# EAGLE design rt_board (EAGLE 6.4)
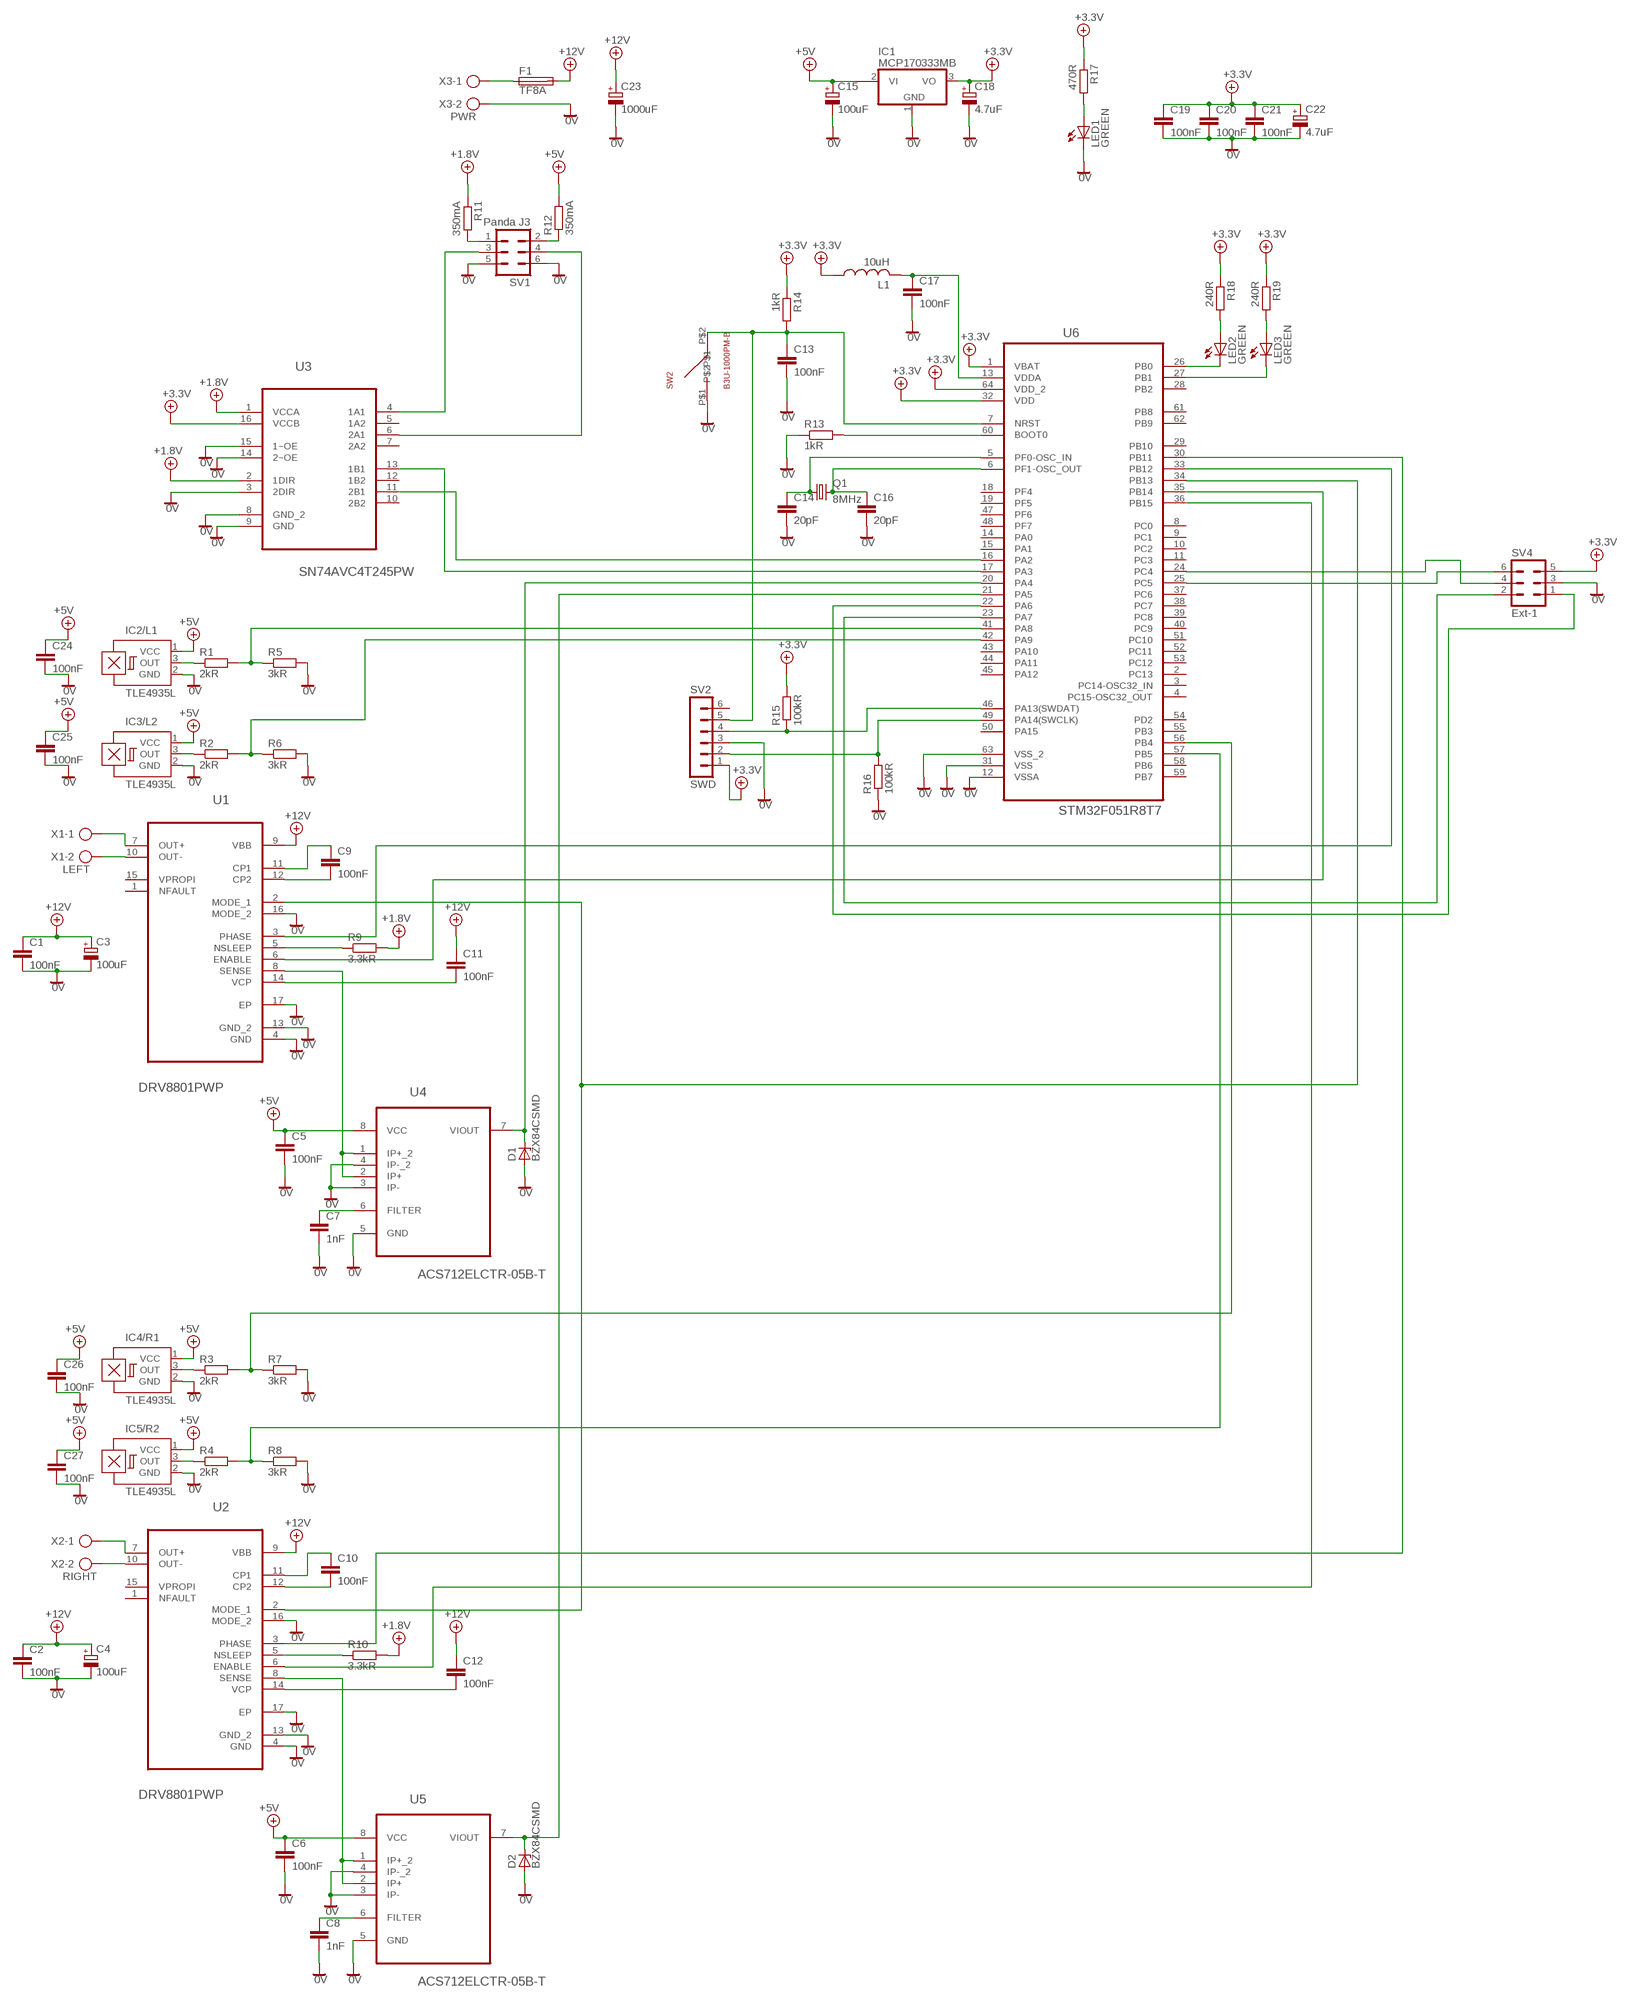
[diagram p0: schematic, sheet 1]

## Parts
C1  100nF  C-EUC1206  [C1206]
C2  100nF  C-EUC1206  [C1206]
C3  100uF  CPOL-EU153CLV-0810  [153CLV-0810]
C4  100uF  CPOL-EU153CLV-0810  [153CLV-0810]
C5  100nF  C-EUC1206  [C1206]
C6  100nF  C-EUC1206  [C1206]
C7  1nF  C-EUC1206  [C1206]
C8  1nF  C-EUC1206  [C1206]
C9  100nF  C-EUC1206  [C1206]
C10  100nF  C-EUC1206  [C1206]
C11  100nF  C-EUC1206  [C1206]
C12  100nF  C-EUC1206  [C1206]
C13  100nF  C-EUC1206  [C1206]
C14  20pF  C-EUC0603  [C0603]
C15  100uF  CPOL-EU153CLV-0605  [153CLV-0605]
C16  20pF  C-EUC0603  [C0603]
C17  100nF  C-EUC1206  [C1206]
C18  4.7uF  CPOL-EU153CLV-0405  [153CLV-0405]
C19  100nF  C-EUC1206  [C1206]
C20  100nF  C-EUC1206  [C1206]
C21  100nF  C-EUC1206  [C1206]
C22  4.7uF  CPOL-EU153CLV-0405  [153CLV-0405]
C23  1000uF  CPOL-EU153CLV-1014  [153CLV-1014]
C24  100nF  C-EUC1206  [C1206]
C25  100nF  C-EUC1206  [C1206]
C26  100nF  C-EUC1206  [C1206]
C27  100nF  C-EUC1206  [C1206]
D1  BZX84CSMD  [TO236]
D2  BZX84CSMD  [TO236]
F1  TF8A  SH22  [SH22]
IC1  MCP170333MB  [SOT89]
IC2/L1  TLE4935L  A1202UA  [SIP3-UA]
IC3/L2  TLE4935L  A1202UA  [SIP3-UA]
IC4/R1  TLE4935L  A1202UA  [SIP3-UA]
IC5/R2  TLE4935L  A1202UA  [SIP3-UA]
L1  10uH  L-USL2012C  [L2012C]
LED1  GREEN  LEDCHIPLED_0603  [CHIPLED_0603]
LED2  GREEN  LEDCHIPLED_0603  [CHIPLED_0603]
LED3  GREEN  LEDCHIPLED_0603  [CHIPLED_0603]
Q1  8MHz  MC-405  [MC-405]
R1  2kR  R-EU_R0603  [R0603]
R2  2kR  R-EU_R0603  [R0603]
R3  2kR  R-EU_R0603  [R0603]
R4  2kR  R-EU_R0603  [R0603]
R5  3kR  R-EU_R0603  [R0603]
R6  3kR  R-EU_R0603  [R0603]
R7  3kR  R-EU_R0603  [R0603]
R8  3kR  R-EU_R0603  [R0603]
R9  3.3kR  R-EU_R0603  [R0603]
R10  3.3kR  R-EU_R0603  [R0603]
R11  350mA  R-EU_MELF0204W  [MINI_MELF-0204W]
R12  350mA  R-EU_MELF0204W  [MINI_MELF-0204W]
R13  1kR  R-EU_R0603  [R0603]
R14  1kR  R-EU_R0603  [R0603]
R15  100kR  R-EU_R0603  [R0603]
R16  100kR  R-EU_R0603  [R0603]
R17  470R  R-EU_R0603  [R0603]
R18  240R  R-EU_R0603  [R0603]
R19  240R  R-EU_R0603  [R0603]
SV1  Panda J3  MA03-2  [MA03-2]
SV2  SWD  MA06-1  [MA06-1]
SV4  Ext-1  MA03-2  [MA03-2]
SW2  B3U-1000PM-B  [SPST-NO]
U1  DRV8801PWP  [SOP65P640X120-17N]
U2  DRV8801PWP  [SOP65P640X120-17N]
U3  SN74AVC4T245PW  [SOP65P640X120-16N]
U4  ACS712ELCTR-05B-T  ACS712ELCTR-20A-T  [SOIC127P600X175-8N]
U5  ACS712ELCTR-05B-T  ACS712ELCTR-20A-T  [SOIC127P600X175-8N]
U6  STM32F051R8T7  STM32F051R8T6  [QFP50P1200X1200X160-64N]
X1  LEFT  AK300/2  [AK300/2]
X2  RIGHT  AK300/2  [AK300/2]
X3  PWR  AK300/2  [AK300/2]

## Nets
0V: C1.2 C2.2 C3.- C4.- C5.2 C6.2 C7.2 C8.2 C13.2 C14.2 C15.- C16.2 C17.2 C18.- C19.2 C20.2 C21.2 C22.- C23.- C24.2 C25.2 C26.2 C27.2 D1.A D2.A IC1.1(GND) IC2/L1.2(GND) IC3/L2.2(GND) IC4/R1.2(GND) IC5/R2.2(GND) LED1.C R5.2 R6.2 R7.2 R8.2 R13.1 R16.1 SV1.5 SV1.6 SV2.3 SV4.3 SW2.P$1 U1.4(GND) U1.13(GND_2) U1.16(MODE_2) U1.17(EP) U2.4(GND) U2.13(GND_2) U2.16(MODE_2) U2.17(EP) U3.3(2DIR) U3.8(GND_2) U3.9(GND) U3.14(2~OE) U3.15(1~OE) U4.3(IP-) U4.4(IP-_2) U4.5(GND) U5.3(IP-) U5.4(IP-_2) U5.5(GND) U6.12(VSSA) U6.31(VSS) U6.63(VSS_2) X3.2
+5V: C18.+ C19.1 C20.1 C21.1 C22.+ IC1.3(VO) L1.1 R14.1 R15.2 R17.1 R18.1 R19.1 SV2.1 SV4.5 U3.16(VCCB) U6.1(VBAT) U6.32(VDD) U6.64(VDD_2) ; supply symbol labelled +3.3V
+5V/1: C5.1 C6.1 C15.+ C24.1 C25.1 C26.1 C27.1 IC1.2@1(VI1) IC2/L1.1(VCC) IC3/L2.1(VCC) IC4/R1.1(VCC) IC5/R2.1(VCC) R12.2 U4.8(VCC) U5.8(VCC) ; supply symbol labelled +5V
+5V/4: R9.2 R10.2 R11.1 U3.1(VCCA) U3.2(1DIR) ; supply symbol labelled +1.8V
+12V: C1.1 C2.1 C3.+ C4.+ C11.1 C12.1 C23.+ F1.2 U1.9(VBB) U2.9(VBB)
N$1: LED2.C U6.26(PB0)
N$2: F1.1 X3.1
N$3: C17.1 L1.2 U6.13(VDDA)
N$4: R16.2 SV2.2 U6.49(PA14(SWCLK))
N$5: R13.2 U6.60(BOOT0)
N$6: C13.1 R14.2 SV2.5 SW2.P$2 U6.7(NRST)
N$7: C14.1 Q1.1 U6.5(PF0-OSC_IN)
N$8: C16.1 Q1.2 U6.6(PF1-OSC_OUT)
N$9: R15.1 SV2.4 U6.46(PA13(SWDAT))
N$10: R12.1 SV1.2
N$11: R11.2 SV1.1
N$12: SV1.3 U3.4(1A1)
N$13: U3.13(1B1) U6.17(PA3)
N$14: U3.11(2B1) U6.16(PA2)
N$15: SV1.4 U3.6(2A1)
N$16: IC2/L1.3(OUT) R1.1
N$17: R1.2 R5.1 U6.41(PA8)
N$18: IC3/L2.3(OUT) R2.1
N$19: R2.2 R6.1 U6.42(PA9)
N$20: U1.7(OUT+) X1.1
N$21: U1.10(OUT-) X1.2
N$22: U1.8(SENSE) U4.1(IP+_2) U4.2(IP+)
N$23: D1.C U4.7(VIOUT) U6.20(PA4)
N$24: C7.1 U4.6(FILTER)
N$25: R9.1 U1.5(NSLEEP)
N$26: C11.2 U1.14(VCP)
N$27: C9.2 U1.12(CP2)
N$28: C9.1 U1.11(CP1)
N$29: IC4/R1.3(OUT) R3.1
N$30: R3.2 R7.1 U6.56(PB4)
N$31: IC5/R2.3(OUT) R4.1
N$32: R4.2 R8.1 U6.57(PB5)
N$33: U2.7(OUT+) X2.1
N$34: U2.10(OUT-) X2.2
N$35: C8.1 U5.6(FILTER)
N$36: U2.8(SENSE) U5.1(IP+_2) U5.2(IP+)
N$37: D2.C U5.7(VIOUT) U6.21(PA5)
N$38: R10.1 U2.5(NSLEEP)
N$39: C12.2 U2.14(VCP)
N$40: C10.2 U2.12(CP2)
N$41: C10.1 U2.11(CP1)
N$42: U1.2(MODE_1) U2.2(MODE_1) U6.34(PB13)
N$43: LED1.A R17.2
N$44: LED2.A R18.2
N$45: U1.6(ENABLE) U6.35(PB14)
N$46: U2.6(ENABLE) U6.36(PB15)
N$47: LED3.C U6.27(PB1)
N$48: U1.3(PHASE) U6.33(PB12)
N$49: U2.3(PHASE) U6.30(PB11)
N$51: LED3.A R19.2
N$52: SV4.6 U6.25(PC5)
N$53: SV4.4 U6.24(PC4)
N$54: SV4.2 U6.23(PA7)
N$55: SV4.1 U6.22(PA6)
Unconnected: IC1.2(VI) SV2.6 U1.1(NFAULT) U1.15(VPROPI) U2.1(NFAULT) U2.15(VPROPI) U3.5(1A2) U3.7(2A2) U3.10(2B2) U3.12(1B2) U6.2(PC13) U6.3(PC14-OSC32_IN) U6.4(PC15-OSC32_OUT) U6.8(PC0) U6.9(PC1) U6.10(PC2) U6.11(PC3) U6.14(PA0) U6.15(PA1) U6.18(PF4) U6.19(PF5) U6.28(PB2) U6.29(PB10) U6.37(PC6) U6.38(PC7) U6.39(PC8) U6.40(PC9) U6.43(PA10) U6.44(PA11) U6.45(PA12) U6.47(PF6) U6.48(PF7) U6.50(PA15) U6.51(PC10) U6.52(PC11) U6.53(PC12) U6.54(PD2) U6.55(PB3) U6.58(PB6) U6.59(PB7) U6.61(PB8) U6.62(PB9)

## Library data of the parts
C1 C2 C5-C14 C16 C17 C19-C21 C24-C27 = rcl:C-EU: CAPACITOR, European symbol
C3 C4 C15 C18 C22 C23 = rcl:CPOL-EU: POLARIZED CAPACITOR, European symbol
D1 D2 = diode:BZX84CSMD: Z DIODE
F1 = fuse:SH22: FUSE HOLDER CS PFP30, Schukat; OC_FARNELL: unknown; OC_NEWARK: unknown
IC1 = linear:MCP1703*: 250 mA, 16V, Low Quiescent Current LDO Regulator Source: http://ww1.microchip.com/downloads/en/DeviceDoc/22049b.pdf
IC2/L1 IC3/L2 IC4/R1 IC5/R2 = allegro:A12*?: Hall-effect bipolar switch Source: http://www.allegromicro.com/en/Products/Part_Numbers/1202/1202.pdf; OC_FARNELL: unknown; OC_NEWARK: unknown
L1 = rcl:L-US: INDUCTOR, American symbol
LED1-LED3 = led:LED: LED OSRAM: - CHIPLED LG R971, LG N971, LY N971, LG Q971, LY Q971, LO R971, LY R971 LH N974, LH R974 LS Q976, LO Q976, LY Q976 LO Q996 - Hyper CHIPLED LW Q18S LB Q993, LB Q99A, LB R99A - SideLED LS A670, LO A670, LY A670, LG A670, LP A670 LB A673, LV A673, LT A673, LW A673 LH A674 LY A675 LS A676, LA A676, LO A676, LY A676, LW A676 LS A679, LY A679, LG A679 - Hyper Micro SIDELED® LS Y876, LA Y876, LO Y876, LY Y876 LT Y87S - SmartLED LW L88C, LW L88S LB L89C, LB L89S, LG L890 LS L89K, LO L89K, LY L89K LS L896, LA L896, LO L896, LY L896 - TOPLED LS T670, LO T670, LY T670, LG T670, LP T670 LSG T670, LSP T670, LSY T670, LOP T670, LYG T670 LG T671, LOG T671, LSG T671 LB T673, LV T673, LT T673, LW T673 LH T674 LS T676, LA T676, LO T676, LY T676, LB T676, LH T676, LSB T676, LW T676 LB T67C, LV T67C, LT T67C, LS T67K, LO T67K, LY T67K, LW E67C LS E67B, LA E67B, LO E67B, LY E67B, LB E67C, LV E67C, LT E67C LW T67C LS T679, LY T679, LG T679 LS T770, LO T770, LY T770, LG T770, LP T770 LB T773, LV T773, LT T773, LW T773 LH T774 LS E675, LA E675, LY E675, LS T675 LS T776, LA T776, LO T776, LY T776, LB T776 LHGB T686 LT T68C, LB T68C - Hyper Mini TOPLED® LB M676 - Mini TOPLED Santana® LG M470 LS M47K, LO M47K, LY M47K Source: http://www.osram.convergy.de LUXEON: - LUMILED® LXK2-PW12-R00, LXK2-PW12-S00, LXK2-PW14-U00, LXK2-PW14-V00 LXK2-PM12-R00, LXK2-PM12-S00, LXK2-PM14-U00 LXK2-PE12-Q00, LXK2-PE12-R00, LXK2-PE12-S00, LXK2-PE14-T00, LXK2-PE14-U00 LXK2-PB12-K00, LXK2-PB12-L00, LXK2-PB12-M00, LXK2-PB14-N00, LXK2-PB14-P00, LXK2-PB14-Q00 LXK2-PR12-L00, LXK2-PR12-M00, LXK2-PR14-Q00, LXK2-PR14-R00 LXK2-PD12-Q00, LXK2-PD12-R00, LXK2-PD12-S00 LXK2-PH12-R00, LXK2-PH12-S00 LXK2-PL12-P00, LXK2-PL12-Q00, LXK2-PL12-R00 Source: www.luxeon.com KINGBRIGHT: KA-3528ASYC Source: www.kingbright.com
Q1 = crystal:MC-405: kHz RANGE CRYSTAL UNIT SMD Source: MC-306_405_406_E07X.PDF Homepage <http://www.epsontoyocom.co.jp>; OC_FARNELL: unknown; OC_NEWARK: unknown
R1-R19 = rcl:R-EU_: RESISTOR, European symbol
SV1 SV4 = con-lstb:MA03-2: PIN HEADER; OC_FARNELL: unknown; OC_NEWARK: unknown
SV2 = con-lstb:MA06-1: PIN HEADER; OC_FARNELL: unknown; OC_NEWARK: unknown
SW2 = basz:B3U-1000PM-B: B3U-1000PM-B microswitch
U1 U2 = TI-DRV8801PWP:DRV8801PWP: DMOS FULL-BRIDGE MOTOR DRIVERS; MPN: DRV8801PWP; OC_FARNELL: 1754826; OC_NEWARK: 24R9114; PACKAGE: TSSOP-16; SUPPLIER: TEXAS INSTRUMENTS
U3 = TI-SN74AVC4T245PW:SN74AVC4T245PW: DUAL-SUPPLY BUS TRANSCEIVER; MPN: SN74AVC4T245PW; OC_FARNELL: 1053499; OC_NEWARK: 33K5889; PACKAGE: SOP-16; SUPPLIER: Texas Instruments
U4 U5 = Allegro-ACS712ELCTR-20A-T:ACS712ELCTR-20A-T: Linear Current Sensor; MPN: ACS712ELCTR-20A-T; OC_FARNELL: 1329624; OC_NEWARK: 31M3133; PACKAGE: SOIC-8; SUPPLIER: Allegro
U6 = stm32f51r8r6:STM32F051R8T6: MCU, 32BIT, ARM CORTEX-M0, 64LQFP; MPN: STM32F051R8T6; OC_FARNELL: 2115071; OC_NEWARK: 05W5808; PACKAGE: 64LQFP; SUPPLIER: STMicroelectronics
X1-X3 = con-ptr500:AK300/2: CONNECTOR; OC_FARNELL: unknown; OC_NEWARK: unknown

## Board
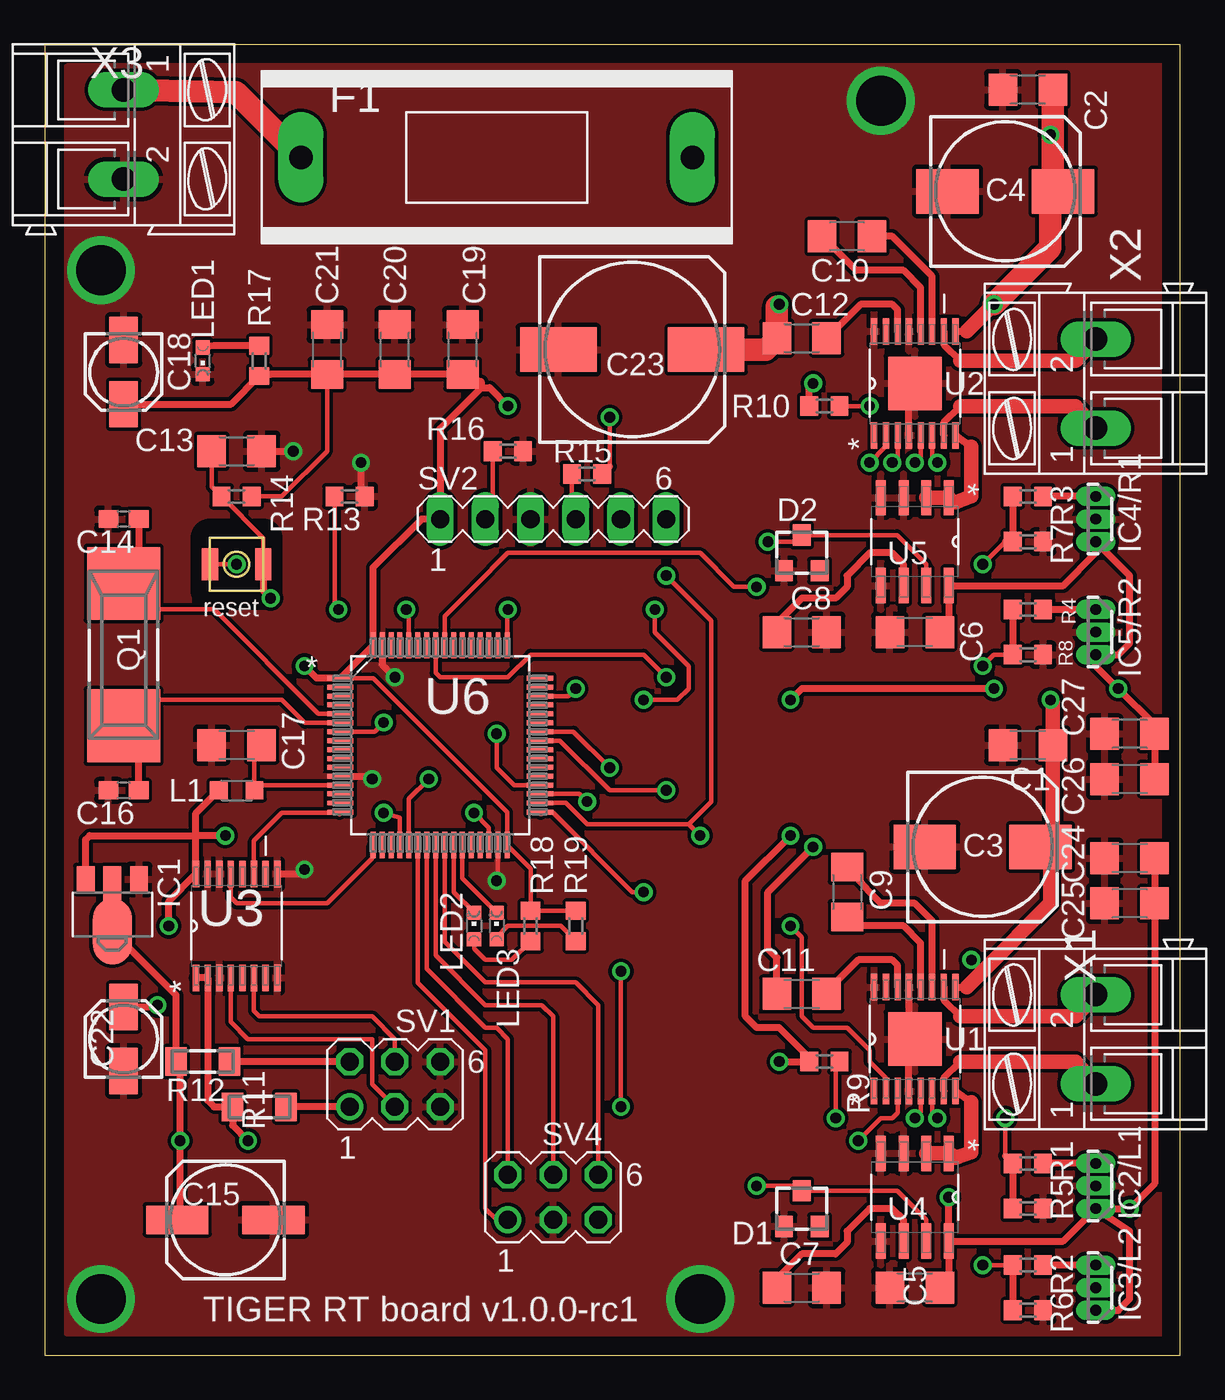
[diagram p1: board, top side]
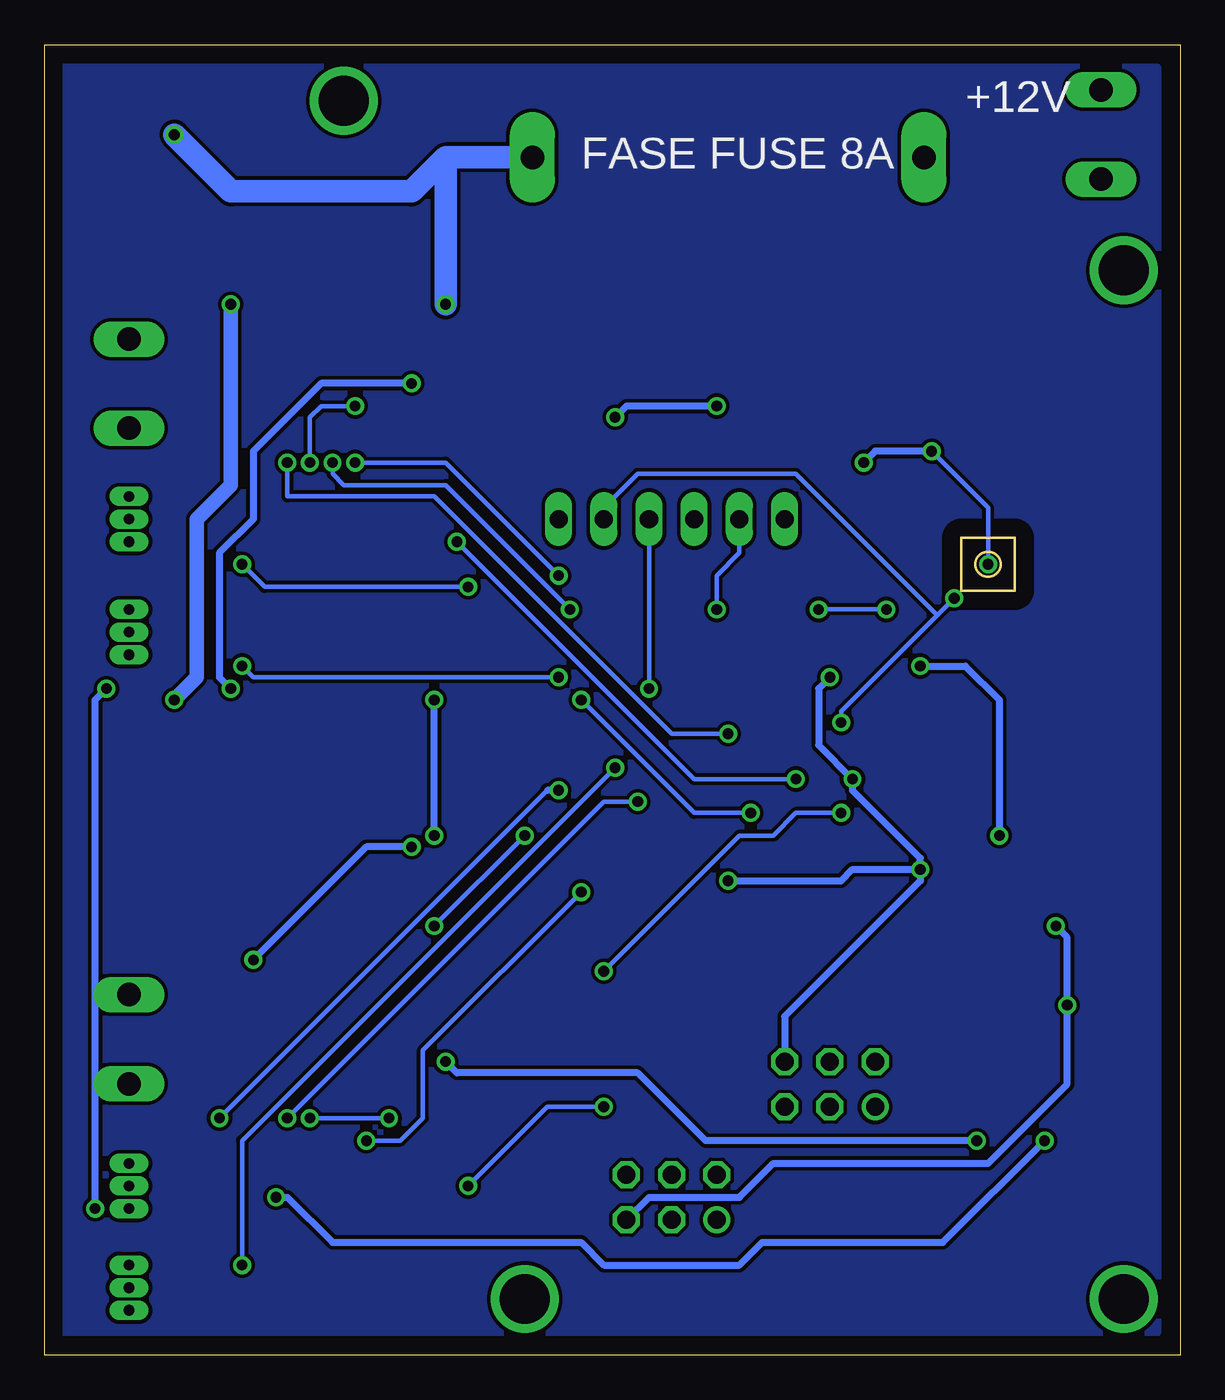
[diagram p2: board, bottom side, seen from below]

Size 63.8 x 73.65 mm. Coordinates in mm from the lower left corner, seen from the top.
Outline: 0,0 63.8,0 63.8,73.65 0,73.65 0,0
Copper layers (1*16): Top 0.035mm / dielectric 1.5mm / Bottom 0.035mm
Design rules "default": minimum track width 10mil, minimum drill 24mil, track to track 8mil, track to pad 8mil, pad to pad 8mil, via to via 8mil, smd to smd 8mil, copper to edge 40mil, drill to drill 8mil, minimum pad ring 10mil, minimum via ring 8mil, stop-mask expansion 4mil, vias tented up to drill 0mil, thermal gap 10mil

### Footprints (pad centres in the part's own frame; a part is rotated, then mirrored left to right if it is on the bottom)
C1206 = smd 1.6 x 1.8: 1 -1.4,0; 2 1.4,0
153CLV-0810 = smd 3.5 x 2.5: + 3.25,0; - -3.25,0
C0603 = smd 1.1 x 1: 1 -0.85,0; 2 0.85,0
153CLV-0605 = smd 3.5 x 1.6: + 2.7,0; - -2.7,0
153CLV-0405 = smd 2.6 x 1.6: + 1.8,0; - -1.8,0
153CLV-1014 = smd 4.3 x 2.5: + 4.15,0; - -4.15,0
TO236 = smd 1 x 1.2: A -1,-1; C 0,1; NC 1,-1
SH22 = drill 1.321 pad 2.54 long: 1 -10.998,0; 2 10.998,0
SOT89 = smd 1 x 1.5: 1 -1.499,-1.981; 3 1.499,-1.981 | smd 1 x 2: 2 0,-1.727 | smd 2.2 x 3.7: 2@1 0,0.94
SIP3-UA = drill 0.6 pad 0.7 long: 1 -1.27,0; 2 0,0; 3 1.27,0
L2012C = smd 1 x 1: 1 -1,0; 2 1,0
CHIPLED_0603 = smd 0.8 x 0.8: A 0,-0.75; C 0,0.75
MC-405 = smd 4.1 x 4.1: 1 -4,0; 2 4,0
R0603 = smd 1 x 1.1: 1 -0.85,0; 2 0.85,0
MINI_MELF-0204W = smd 1.2 x 1.6: 1 -1.5,0; 2 1.5,0
MA03-2 = drill 1.016: 1 -2.54,-1.27 | drill 1.016 octagon: 2 -2.54,1.27; 3 0,-1.27; 4 0,1.27; 5 2.54,-1.27; 6 2.54,1.27
MA06-1 = drill 1.016 long: 1 -6.35,0; 2 -3.81,0; 3 -1.27,0; 4 1.27,0; 5 3.81,0; 6 6.35,0
SPST-NO = smd 0.914 x 1.778: P$1 -1.5,0; P$2 1.5,0
SOP65P640X120-17N = smd 1.473 x 0.356: 1 -2.921,2.286; 2 -2.921,1.626; 3 -2.921,0.965; 4 -2.921,0.33; 5 -2.921,-0.33; 6 -2.921,-0.965; 7 -2.921,-1.626; 8 -2.921,-2.286; 9 2.921,-2.286; 10 2.921,-1.626; 11 2.921,-0.965; 12 2.921,-0.33; 13 2.921,0.33; 14 2.921,0.965; 15 2.921,1.626; 16 2.921,2.286 | smd 2.997 x 2.997: 17 0,0
SOP65P640X120-16N = smd 1.473 x 0.356: 1 -2.921,2.286; 2 -2.921,1.626; 3 -2.921,0.965; 4 -2.921,0.33; 5 -2.921,-0.33; 6 -2.921,-0.965; 7 -2.921,-1.626; 8 -2.921,-2.286; 9 2.921,-2.286; 10 2.921,-1.626; 11 2.921,-0.965; 12 2.921,-0.33; 13 2.921,0.33; 14 2.921,0.965; 15 2.921,1.626; 16 2.921,2.286
SOIC127P600X175-8N = smd 1.981 x 0.559: 1 -2.464,1.905; 2 -2.464,0.635; 3 -2.464,-0.635; 4 -2.464,-1.905; 5 2.464,-1.905; 6 2.464,-0.635; 7 2.464,0.635; 8 2.464,1.905
QFP50P1200X1200X160-64N = smd 1.473 x 0.279: 1 -5.613,3.759; 2 -5.613,3.251; 3 -5.613,2.743; 4 -5.613,2.261; 5 -5.613,1.753; 6 -5.613,1.245; 7 -5.613,0.762; 8 -5.613,0.254; 9 -5.613,-0.254; 10 -5.613,-0.762; 11 -5.613,-1.245; 12 -5.613,-1.753; 13 -5.613,-2.261; 14 -5.613,-2.743; 15 -5.613,-3.251; 16 -5.613,-3.759; 33 5.613,-3.759; 34 5.613,-3.251; 35 5.613,-2.743; 36 5.613,-2.261; 37 5.613,-1.753; 38 5.613,-1.245; 39 5.613,-0.762; 40 5.613,-0.254; 41 5.613,0.254; 42 5.613,0.762; 43 5.613,1.245; 44 5.613,1.753; 45 5.613,2.261; 46 5.613,2.743; 47 5.613,3.251; 48 5.613,3.759 | smd 0.279 x 1.473: 17 -3.759,-5.613; 18 -3.251,-5.613; 19 -2.743,-5.613; 20 -2.261,-5.613; 21 -1.753,-5.613; 22 -1.245,-5.613; 23 -0.762,-5.613; 24 -0.254,-5.613; 25 0.254,-5.613; 26 0.762,-5.613; 27 1.245,-5.613; 28 1.753,-5.613; 29 2.261,-5.613; 30 2.743,-5.613; 31 3.251,-5.613; 32 3.759,-5.613; 49 3.759,5.613; 50 3.251,5.613; 51 2.743,5.613; 52 2.261,5.613; 53 1.753,5.613; 54 1.245,5.613; 55 0.762,5.613; 56 0.254,5.613; 57 -0.254,5.613; 58 -0.762,5.613; 59 -1.245,5.613; 60 -1.753,5.613; 61 -2.261,5.613; 62 -2.743,5.613; 63 -3.251,5.613; 64 -3.759,5.613
AK300/2 = drill 1.321 long: 1 -2.515,0; 2 2.489,0

### Placement (x,y rotation side)
C1  55.25,34.29 180 top
C2  55.25,71.12 180 top
C3  52.7,28.57 0 top
C4  53.97,65.41 0 top
C5  48.89,3.81 180 top
C6  48.89,40.64 180 top
C7  42.55,3.81 0 top
C8  42.55,40.64 0 top
C9  45.09,26.03 270 top
C10  45.09,62.87 180 top
C11  42.55,20.32 0 top
C12  42.55,57.15 0 top
C13  10.79,50.8 0 top
C14  4.45,46.99 180 top
C15  10.16,7.62 180 top
C16  4.45,31.75 180 top
C17  10.79,34.29 180 top
C18  4.45,55.24 270 top
C19  23.49,56.52 90 top
C20  19.69,56.52 90 top
C21  15.88,56.52 90 top
C22  4.45,17.78 90 top
C23  33.02,56.52 0 top
C24  60.96,27.94 180 top
C25  60.96,25.4 180 top
C26  60.96,32.38 180 top
C27  60.96,34.92 180 top
D1  42.55,8.26 0 top
D2  42.55,45.09 0 top
F1  25.4,67.31 0 top
IC1  3.81,24.77 180 top
IC2/L1  59.05,9.53 90 top
IC3/L2  59.05,3.81 90 top
IC4/R1  59.05,46.99 90 top
IC5/R2  59.05,40.64 90 top
L1  10.79,31.75 0 top
LED1  8.89,55.88 180 top
LED2  24.13,24.13 0 top
LED3  25.4,24.13 0 top
Q1  4.45,39.37 270 top
R1  55.25,10.79 180 top
R2  55.25,5.08 180 top
R3  55.25,48.26 180 top
R4  55.25,41.91 180 top
R5  55.25,8.26 0 top
R6  55.25,2.54 0 top
R7  55.25,45.72 0 top
R8  55.25,39.37 0 top
R9  43.81,16.51 180 top
R10  43.81,53.34 180 top
R11  12.06,13.97 0 top
R12  8.89,16.51 180 top
R13  17.15,48.26 180 top
R14  10.79,48.26 180 top
R15  30.48,49.53 0 top
R16  26.03,50.8 180 top
R17  12.06,55.88 90 top
R18  27.3,24.13 270 top
R19  29.84,24.13 270 top
SV1  19.69,15.24 0 top
SV2  28.57,46.99 0 top
SV4  28.57,8.89 0 top
SW2  10.79,44.45 0 top
U1  48.89,17.78 90 top
U2  48.89,54.61 90 top
U3  10.79,24.13 90 top
U4  48.89,8.89 270 top
U5  48.89,45.72 270 top
U6  22.23,34.29 0 top
X1  59.05,17.78 90 top
X2  59.05,54.61 90 top
X3  4.45,68.58 270 top

### Tracks (layer width: path | path; a pad name or v marks a point on that pad's centre or on a via)
0V  (via drill 0.6, 2.8)
  Top 0.254: SW2.P$1 v10.79,44.45 | U6.31 25.48,26.75
  Top 0.406: U3.9 14.35,27.05 v14.6,27.3 | C13.2 v13.97,50.8 | v17.78,50.16 17.78,48.48 R13.1 | U1.4 48.56,17.45 U1.17 48.56,18.11 U1.13 | U2.4 48.56,54.28 U2.17 | U6.12 17.93,32.54 v18.41,32.38 | U6.63 18.97,38.81 v19.69,38.1 | 25.48,26.75 v25.4,26.67
  Bottom 0.254: v10.79,44.45 10.79,47.62 v13.97,50.8
  Bottom 0.406: v14.6,27.3 14.6,26.67 22.23,19.05 SV1.6 | v13.97,50.8 17.15,50.8 v17.78,50.16 | v14.6,27.3 14.6,27.94 18.41,31.75 v18.41,32.38 20.32,34.29 20.32,37.46 v19.69,38.1 | v25.4,26.67 19.05,26.67 18.41,27.3 v14.6,27.3
  other vias: 3.18,60.96 3.18,3.18 36.83,3.18 46.99,70.48
  pour Top: 1.27,72.39 1.27,1.27 62.86,1.27 62.86,72.39
+5V  (via drill 0.6)
  Top 0.254: R14.1 13.33,48.26 15.88,50.8 C21.1 | U6.1 18.47,38.05 25.98,30.53 U6.32 27.3,27.36 R18.1 R19.1 | v31.75,52.7 31.75,49.95
  Top 0.406: 8.51,29.21 U3.16 6.99,25.53 v6.99,24.13 | 8.51,29.21 8.51,30.46 L1.1 | IC1.3 2.31,28.98 2.54,29.21 8.51,29.21 | 24.53,54.38 24.53,54.71 C19.1 C20.1 C21.1 12.7,55.12 R17.1 10.48,53.45 C18.+ | 24.53,54.38 22.23,52.07 SV2.1 21.19,46.99 18.47,44.27 U6.64 U6.1 15.29,38.05 v14.6,38.73 | v10.16,29.21 8.51,29.21 | 24.53,54.38 25,54.38 v26.03,53.34 | 31.75,49.95 R15.2 | C22.+ 6.24,19.58 v6.35,19.69 | 30.06,24.77 R19.1
  Bottom 0.406: v14.6,38.73 12.06,38.73 10.16,36.83 v10.16,29.21 | v26.03,53.34 31.11,53.34 v31.75,52.7 | v6.99,24.13 6.35,23.49 v6.35,19.69 6.35,15.24 10.79,10.79 22.86,10.79 24.77,8.89 29.84,8.89 SV4.5
+5V/1  (via drill 0.6)
  Top 0.406: U4.8 50.8,4.31 C5.1 | U4.8 57.23,6.43 IC2/L1.1 | IC3/L2.1 60.33,2.54 60.96,3.18 60.96,6.99 IC2/L1.1 | C6.1 50.8,41.14 U5.8 57.23,43.26 59.05,45.09 IC4/R1.1 60.96,43.81 60.96,40 60.33,39.37 IC5/R2.1 59.05,38.73 v60.33,37.46 62.36,35.43 C27.1 C26.1 | IC2/L1.1 v60.96,8.26 62.36,9.65 C25.1 C24.1 | IC1.2@1 7.39,20.24 R12.2 7.62,16.28 v7.62,12.06 7.62,7.62 C15.+ | U4.8 v50.8,8.89
  Bottom 0.406: v60.96,8.26 60.96,36.83 v60.33,37.46 | v50.8,8.89 50.16,8.89 47.62,6.35 33.66,6.35 32.38,5.08 24.77,5.08 23.49,6.35 13.33,6.35 v7.62,12.06
+5V/4  (via drill 0.6)
  Top 0.406: U3.1 U3.2 9.17,14.33 9.53,13.97 R11.1 10.56,12.93 v11.43,12.06 | v41.27,16.51 R9.2 42.96,16.73 41.27,18.41 40,18.41 39.37,19.05 39.37,26.67 v41.91,29.21 | R10.2 42.96,54.39 v43.18,54.61 | v53.34,37.46 42.55,37.46 v41.91,36.83
  Bottom 0.406: v11.43,12.06 26.67,12.06 30.48,15.88 40.64,15.88 v41.27,16.51 | v41.91,29.21 v41.91,36.83 | v43.18,54.61 48.26,54.61 52.07,50.8 52.07,46.99 53.97,45.09 53.97,38.1 v53.34,37.46
+12V  (via drill 0.6)
  Top 0.406: U1.9 51.82,20.7 | 56.52,27.23 56.87,27.59 | 56.87,27.59 C3.+ | 56.64,27.81 56.87,27.59 | U2.9 51.82,57.53 | 56.52,64.06 56.87,64.42 | 56.87,64.42 C4.+ | 56.64,64.64 56.87,64.42 | 56.64,36.7 v56.52,36.83 | 57.15,71.12 56.52,71.25 C2.1 | C11.1 41.14,22.35 40.64,22.86 40.64,26.03 v43.18,28.57 | v52.07,22.23 52.7,21.59 | 56.64,68.58 v56.52,68.58 | 41.14,58.93 v41.27,59.05
  Top 0.813: 51.82,20.7 52.7,21.59 56.52,25.4 56.52,27.23 | 56.64,27.81 C1.1 56.64,36.7 | 51.82,57.53 v53.34,59.05
  Top 1.27: v53.34,59.05 56.52,62.23 56.52,64.06 | C2.1 56.64,68.58 56.64,64.64 | 41.14,58.93 C12.1 40.51,56.52 C23.+
  Bottom 0.406: v43.18,28.57 45.72,28.57 v52.07,22.23
  Bottom 0.813: v56.52,36.83 55.25,38.1 55.25,46.99 53.34,48.89 v53.34,59.05
  Bottom 1.27: F1.2 41.27,67.31 | 41.27,67.31 43.18,65.41 53.34,65.41 v56.52,68.58 | v41.27,59.05 41.27,67.31
N$1
  Top 0.254: U6.26 22.99,26.03 24.13,24.89
  Top 0.406: LED2.C 24.13,24.89
N$2
  Top 1.27: X3.1 10.75,70.97 F1.1
N$3
  Top 0.254: U6.13 12.07,32.03 | L1.2 11.79,33.89
  Top 0.406: 12.07,32.03 L1.2 | 11.79,33.89 C17.1
N$4  (via drill 0.6)
  Top 0.254: R16.2 25.18,47.41 SV2.2 | U6.49 25.98,41.86
  Top 0.406: 25.98,41.86 v26.03,41.91
  Bottom 0.254: v26.03,41.91 26.03,43.81 24.77,45.09 SV2.2
N$5  (via drill 0.6)
  Top 0.254: R13.2 16.3,42.12 v16.51,41.91 | U6.60 20.47,41.76 v20.32,41.91
  Bottom 0.254: v16.51,41.91 v20.32,41.91
N$6  (via drill 0.6)
  Top 0.254: C13.1 9.4,48.81 R14.2 12.29,45.91 SW2.P$2 | U6.7 18.54,35.05 v19.05,35.56
  Top 0.406: SW2.P$2 12.29,42.95 v12.7,42.55
  Bottom 0.254: v12.7,42.55 13.65,41.59 | 13.65,41.59 19.05,36.2 v19.05,35.56 | 32.38,47.62 30.48,49.53 21.59,49.53 13.65,41.59
  Bottom 0.406: SV2.5 32.38,47.62
N$7
  Top 0.254: U6.5 15.39,36.04 9.53,41.91 5.9,41.91
  Top 0.406: 5.9,41.91 Q1.1 5.29,44.22 C14.1
N$8
  Top 0.254: U6.6 14.63,35.53 13.33,36.83 5.9,36.83
  Top 0.406: 5.9,36.83 Q1.2 5.29,34.52 C16.1
N$9  (via drill 0.6)
  Top 0.254: U6.46 29.41,37.03 v29.84,37.46 | R15.1 29.63,47.2 SV2.4
  Bottom 0.254: v29.84,37.46 SV2.4
N$10
  Top 0.406: SV1.2 R12.1
N$11
  Top 0.406: SV1.1 R11.2
N$12
  Top 0.254: U3.4 10.47,18.74 11.43,17.78 18.41,17.78 18.41,15.24 SV1.3
N$13
  Top 0.254: U3.13 10.47,25.73 10.79,25.4 15.88,25.4 18.41,27.94 18.41,28.63 U6.17
N$14
  Top 0.254: U3.11 11.76,28.91 13.33,30.48 16.56,30.48
  Top 0.406: 16.56,30.48 U6.16
N$15
  Top 0.254: U3.6 11.76,19.35 12.06,19.05 18.41,19.05 19.69,17.78 SV1.4
N$16
  Top 0.406: IC2/L1.3 R1.1
N$17  (via drill 0.6)
  Top 0.254: U6.41 28.96,34.54 31.75,31.75 v34.92,31.75 | v53.97,13.33 53.97,11.22
  Top 0.406: R5.1 R1.2 53.97,11.22
  Bottom 0.254: 35.56,31.75 v53.97,13.33
  Bottom 0.406: v34.92,31.75 35.56,31.75
N$18
  Top 0.406: IC3/L2.3 R2.1
N$19  (via drill 0.6)
  Top 0.254: U6.42 29.72,35.05 v31.75,33.02 | v52.7,5.08 R2.2
  Top 0.406: R2.2 R6.1
  Bottom 0.254: v31.75,33.02 52.7,12.06 v52.7,5.08
N$20
  Top 0.406: U1.7 50.52,15.6 51.43,16.51
  Top 0.813: 51.43,16.51 57.94,16.51 X1.1
N$21
  Top 0.406: U1.10 50.52,19.96 51.43,19.05
  Top 0.813: 51.43,19.05 57.94,19.05 X1.2
N$22
  Top 0.406: U1.8 52.07,14.22
  Top 0.813: 52.07,14.22 52.07,11.43 51.18,11.1 U4.1 U4.2
N$23  (via drill 0.6)
  Top 0.254: D1.C 47.89,9.26 49.53,7.62 U4.7 | v40,9.53 42.27,9.53 | U6.20 19.96,30.2 v19.05,30.48 | v32.38,21.59 v32.38,13.97
  Top 0.406: 42.27,9.53 D1.C
  Bottom 0.254: v32.38,13.97 35.56,13.97 v40,9.53 | v19.05,30.48 21.59,30.48 22.86,29.21 24.77,29.21 v32.38,21.59
N$24
  Top 0.406: U4.6 48.26,7.62 47.62,8.26 46.35,8.26 45.09,6.99 45.09,6.35 44.45,5.71 42.55,5.71 41.27,4.45 41.27,3.94 C7.1
N$25  (via drill 0.6)
  Top 0.254: U1.5 49.23,13.67 v48.89,13.33 | v44.45,13.33 44.45,16.3
  Top 0.406: 44.45,16.3 R9.1
  Bottom 0.254: v48.89,13.33 v44.45,13.33
N$26
  Top 0.406: U1.14 47.93,21.92 47.62,22.23 45.72,22.23 44.45,20.95 43.81,20.45 C11.2
N$27
  Top 0.406: U1.12 49.23,23.16 48.26,24.13 45.59,24.13 C9.2
N$28
  Top 0.406: U1.11 49.86,24.44 48.89,25.4 46.99,25.4 46.35,26.03 C9.1
N$29
  Top 0.406: IC4/R1.3 R3.1
N$30  (via drill 0.6)
  Top 0.254: U6.56 22.48,41.53 24.13,43.18 26.03,45.09 36.83,45.09 38.73,43.18 v40,43.18 | v52.7,44.45 53.97,45.72
  Top 0.406: R3.2 R7.1 53.97,45.72
  Bottom 0.254: v40,43.18 51.43,43.18 v52.7,44.45
N$31
  Top 0.406: R4.1 IC5/R2.3
N$32  (via drill 0.6)
  Top 0.254: U6.57 21.97,38.35 22.23,38.1 26.03,38.1 27.3,39.37 33.66,39.37 v34.92,38.1 | v52.7,38.73 53.34,39.37 R8.1
  Top 0.406: R4.2 R8.1
  Bottom 0.254: v34.92,38.1 52.07,38.1 v52.7,38.73
N$33
  Top 0.406: U2.7 50.52,52.43 51.43,53.34
  Top 0.813: 51.43,53.34 57.94,53.34 X2.1
N$34
  Top 0.406: U2.10 50.52,56.79 51.43,55.88
  Top 0.813: 51.43,55.88 57.94,55.88 X2.2
N$35
  Top 0.406: U5.6 48.26,44.45 47.62,45.09 46.35,45.09 45.09,43.81 45.09,43.18 44.45,42.55 42.55,42.55 41.27,41.27 41.27,40.77 C8.1
N$36
  Top 0.406: U2.8 52.07,51.05 | 51.18,47.93 U5.1
  Top 0.813: 52.07,51.05 52.07,48.26 51.18,47.93 | U5.1 U5.2
N$37  (via drill 0.6)
  Top 0.254: U5.7 49.53,44.45 47.89,46.09 D2.C 42.18,45.72 v40.64,45.72 | U6.21 20.47,31.27 v21.59,32.38
  Bottom 0.254: v21.59,32.38 27.3,32.38 v40.64,45.72
N$38  (via drill 0.6)
  Top 0.254: U2.5 49.23,50.49 v48.89,50.16 | R10.1 v46.35,53.34
  Bottom 0.254: v48.89,50.16 48.89,52.7 48.26,53.34 v46.35,53.34
N$39
  Top 0.406: U2.14 47.93,58.75 47.62,59.05 45.85,59.05 C12.2
N$40
  Top 0.406: U2.12 49.23,59.99 48.26,60.96 45.59,60.96 C10.2
N$41
  Top 0.406: U2.11 49.86,60.63 47.62,62.87 C10.1
N$42  (via drill 0.6)
  Top 0.254: U2.2 47.27,51.08 v46.35,50.16 | U6.34 29.29,31.04 30.48,29.84 36.2,29.84 | 36.2,29.84 37.46,31.12 37.46,41.27 v34.92,43.81 | U1.2 47.27,15.6 46.35,16.51 46.35,17.15 45.09,18.41 43.18,18.41 42.55,19.05 42.55,23.49 v41.91,24.13 | v36.83,29.21 36.2,29.84
  Bottom 0.254: v46.35,50.16 41.27,50.16 v34.92,43.81 | v41.91,24.13 v36.83,29.21
N$43
  Top 0.406: R17.2 9.53,56.73 LED1.A
N$44
  Top 0.254: LED2.A 24.13,22.86 24.77,22.23 26.25,22.23 R18.2
N$45  (via drill 0.6)
  Top 0.254: U6.35 30.05,31.55 v30.48,31.12 | U1.6 49.86,13.67 v50.16,13.33
  Bottom 0.254: v50.16,13.33 32.38,31.12 v30.48,31.12
N$46  (via drill 0.6)
  Top 0.254: U6.36 26.39,32.03 25.4,33.02 v25.4,34.92 | U2.6 49.86,50.49 v50.16,50.16
  Bottom 0.254: v25.4,34.92 28.57,34.92 41.91,48.26 50.16,48.26 v50.16,50.16
N$47
  Top 0.254: U6.27 23.47,26.81 LED3.C
N$48  (via drill 0.6)
  Top 0.254: U1.3 47.93,13.64 47.62,13.33 46.99,13.33 v45.72,12.06 | v33.66,26.03 33.02,26.03 28.57,30.48 27.89,30.48
  Top 0.406: 27.89,30.48 U6.33
  Bottom 0.254: v45.72,12.06 43.81,12.06 42.55,13.33 42.55,17.15 v33.66,26.03
N$49  (via drill 0.6)
  Top 0.254: U2.3 47.93,50.47 v47.62,50.16 | v34.29,41.91 34.29,40.64 36.2,38.73 36.2,37.46 35.56,36.83 v33.66,36.83 | U6.30 24.97,29.64 v24.13,30.48
  Bottom 0.254: v47.62,50.16 47.62,49.53 46.99,48.89 41.27,48.89 v34.29,41.91 | v24.13,30.48 27.3,30.48 v33.66,36.83
N$50
  pour Bottom: 1.27,72.39 1.27,1.27 63.5,1.27 63.5,72.39
N$51
  Top 0.254: 25.4,23.49 26.03,24.13 28.99,24.13 R19.2
  Top 0.406: LED3.A 25.4,23.49
N$52
  Top 0.254: U6.25 22.48,23.24 24.77,20.95 29.84,20.95 31.11,19.69 SV4.6
N$53
  Top 0.254: U6.24 21.97,22.48 24.77,19.69 27.94,19.69 28.57,19.05 SV4.4
N$54
  Top 0.254: U6.23 21.46,21.72 24.77,18.41 25.4,18.41 26.03,17.78 SV4.2
N$55
  Top 0.254: U6.22 20.98,20.93 24.77,17.15 24.77,8.26 25.4,7.62 SV4.1

### Text on the board
tNames: reset | TIGER RT board v1.0.0-rc1
bNames: +12V | FASE FUSE 8A